# EAGLE design t2313_attiny_fusebit_hv-doctor_V3 (EAGLE 5.10)
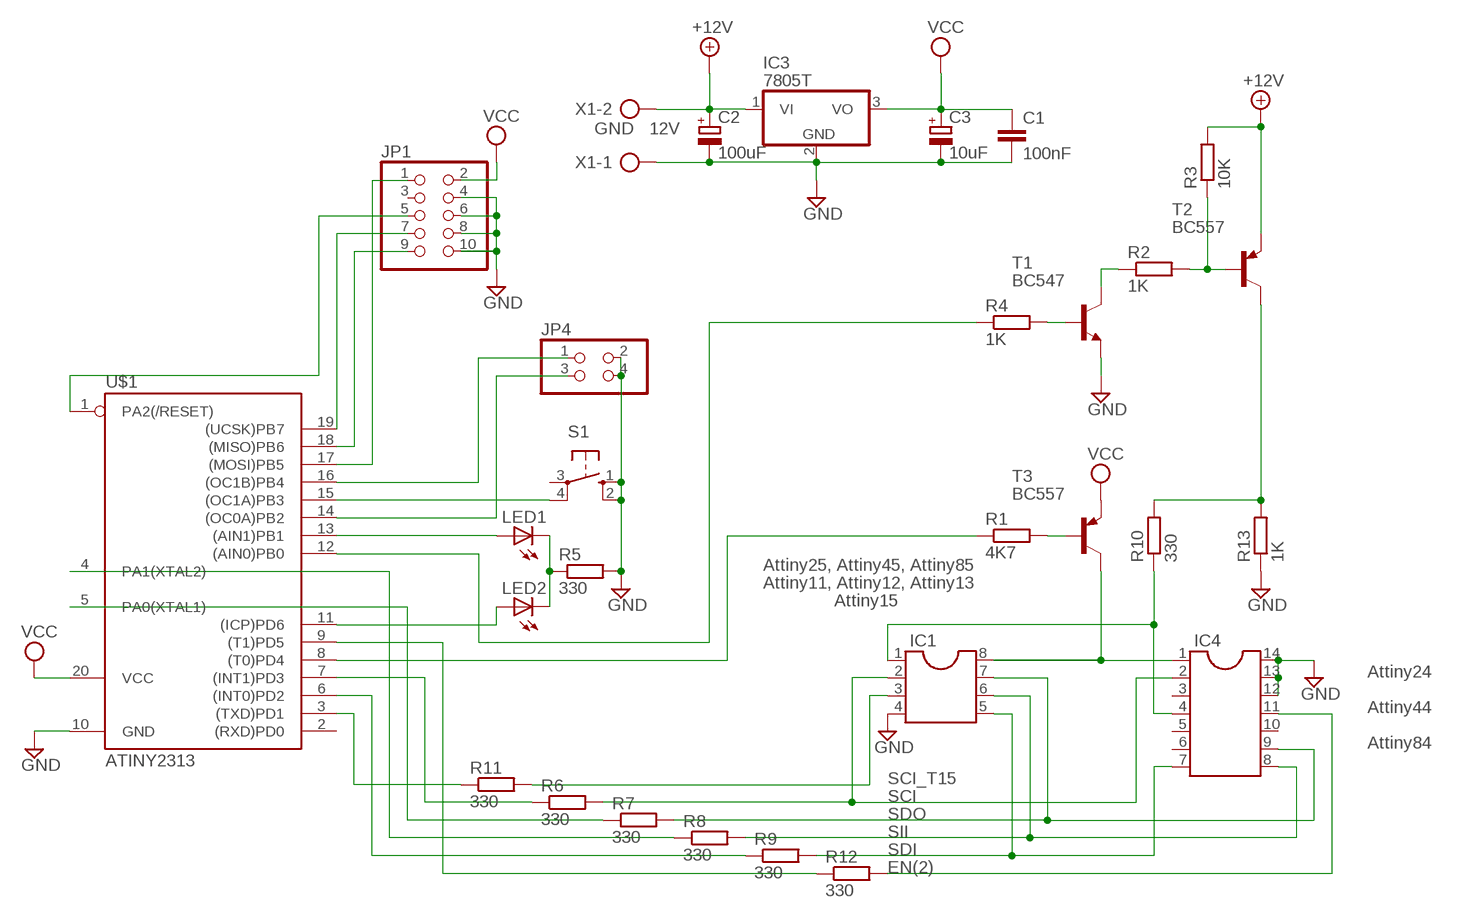
[diagram p0: schematic, sheet 1]

## Parts
C1  100nF  C-EU050-024X044  [C050-024X044]
C2  100uF  CPOL-EUE2.5-6  [E2,5-6]
C3  10uF  CPOL-EUE2.5-6  [E2,5-6]
IC1  DIL8S  [SOCKED-08]
IC3  7805T  [TO220H]
IC4  DIL14S  [SOCKED-14]
JP1  PINHD-2X5  [2X05]
JP4  PINHD-2X2  [2X02]
LED1  LED3MM  [LED3MM]
LED2  LED3MM  [LED3MM]
R1  4K7  R-EU_0207/10  [0207/10]
R2  1K  R-EU_0207/10  [0207/10]
R3  10K  R-EU_0207/10  [0207/10]
R4  1K  R-EU_0207/10  [0207/10]
R5  330  R-EU_0207/10  [0207/10]
R6  330  R-EU_0207/10  [0207/10]
R7  330  R-EU_0207/10  [0207/10]
R8  330  R-EU_0207/10  [0207/10]
R9  330  R-EU_0207/10  [0207/10]
R10  330  R-EU_0207/10  [0207/10]
R11  330  R-EU_0207/10  [0207/10]
R12  330  R-EU_0207/10  [0207/10]
R13  1K  R-EU_0207/10  [0207/10]
S1  10-XX  [B3F-10XX]
T1  BC547  BC547A-NPN-TO92-EBC  [TO92-EBC]
T2  BC557  BC557A-PNP-TO92-EBC  [TO92-EBC]
T3  BC557  BC557A-PNP-TO92-EBC  [TO92-EBC]
U$1  ATINY2313  TINY2313-*P*  [DIL20]
X1  GND 12V  AK500/2  [AK500/2]

## Nets
+12V: C2.+ IC3.1(VI) R3.2 T2.E X1.2
GND: C1.2 C2.- C3.- IC1.4 IC3.2(GND) IC4.12 IC4.13 IC4.14 JP1.4 JP1.6 JP1.8 JP1.10 JP4.2 JP4.4 R5.2 R13.1 S1.1(S) S1.2(S1) T1.E U$1.10(GND) X1.1
N$1: R4.1 U$1.12((AIN0)PB0)
N$2: R1.1 U$1.8((T0)PD4)
N$3: R7.1 U$1.5(PA0(XTAL1))
N$4: R8.1 U$1.4(PA1(XTAL2))
N$5: LED1.K(C) LED2.K(C) R5.1
N$6: R1.2 T3.B
N$7: IC1.1 IC4.4 R10.1
N$8: R2.2 R3.1 T2.B
N$9: R2.1 T1.C
N$10: R4.2 T1.B
N$11: LED1.A U$1.13((AIN1)PB1)
N$12: JP1.5 U$1.1(PA2(/RESET))
N$13: JP1.7 U$1.19((UCSK)PB7)
N$14: JP1.9 U$1.18((MISO)PB6)
N$15: JP1.1 U$1.17((MOSI)PB5)
N$16: IC4.11 R12.2
N$18: JP4.1 U$1.16((OC1B)PB4)
N$19: R6.1 U$1.7((INT1)PD3)
N$20: LED2.A U$1.11((ICP)PD6)
N$21: R12.1 U$1.9((T1)PD5)
N$22: R9.1 U$1.6((INT0)PD2)
N$23: JP4.3 U$1.14((OC0A)PB2)
N$24: S1.4(P1) U$1.15((OC1A)PB3)
N$25: R10.2 R13.2 T2.C
N$26: IC1.3 R11.2
N$27: R11.1 U$1.3((TXD)PD1)
N$29: IC1.8 IC4.1 T3.C
SCI: IC1.2 IC4.2 R6.2
SDI: IC1.5 IC4.7 R9.2
SDO: IC1.7 IC4.9 R7.2
SII: IC1.6 IC4.8 R8.2
VCC: C1.1 C3.+ IC3.3(VO) JP1.2 T3.E U$1.20(VCC)
Unconnected: IC4.3 IC4.5 IC4.6 IC4.10 JP1.3 S1.3(P) U$1.2((RXD)PD0)

## Notes on the sheet
- Attiny25, Attiny45, Attiny85
- Attiny11, Attiny12, Attiny13
- Attiny15
- Attiny24
- Attiny44
- Attiny84
- SCI_T15
- SCI
- SDO
- SII
- SDI
- EN(2)

## Library data of the parts
C1 = rcl:C-EU: CAPACITOR, European symbol
C2 C3 = rcl:CPOL-EU: POLARIZED CAPACITOR, European symbol
IC1 = ic-package:DIL8: Dual In Line
IC3 = linear:78*: Positive VOLTAGE REGULATOR Source: http://cache.national.com/ds/LM/LM78L05.pdf http://www.fairchildsemi.com/ds/LM/LM7805.pdf
IC4 = ic-package:DIL14: Dual In Line
JP1 = pinhead:PINHD-2X5: PIN HEADER
JP4 = pinhead:PINHD-2X2: PIN HEADER
LED1 LED2 = led:LED: LED OSRAM: - CHIPLED LG R971, LG N971, LY N971, LG Q971, LY Q971, LO R971, LY R971 LH N974, LH R974 LS Q976, LO Q976, LY Q976 LO Q996 - Hyper CHIPLED LW Q18S LB Q993, LB Q99A, LB R99A - SideLED LS A670, LO A670, LY A670, LG A670, LP A670 LB A673, LV A673, LT A673, LW A673 LH A674 LY A675 LS A676, LA A676, LO A676, LY A676, LW A676 LS A679, LY A679, LG A679 - Hyper Micro SIDELED® LS Y876, LA Y876, LO Y876, LY Y876 LT Y87S - SmartLED LW L88C, LW L88S LB L89C, LB L89S, LG L890 LS L89K, LO L89K, LY L89K LS L896, LA L896, LO L896, LY L896 - TOPLED LS T670, LO T670, LY T670, LG T670, LP T670 LSG T670, LSP T670, LSY T670, LOP T670, LYG T670 LG T671, LOG T671, LSG T671 LB T673, LV T673, LT T673, LW T673 LH T674 LS T676, LA T676, LO T676, LY T676, LB T676, LH T676, LSB T676, LW T676 LB T67C, LV T67C, LT T67C, LS T67K, LO T67K, LY T67K, LW E67C LS E67B, LA E67B, LO E67B, LY E67B, LB E67C, LV E67C, LT E67C LW T67C LS T679, LY T679, LG T679 LS T770, LO T770, LY T770, LG T770, LP T770 LB T773, LV T773, LT T773, LW T773 LH T774 LS E675, LA E675, LY E675, LS T675 LS T776, LA T776, LO T776, LY T776, LB T776 LHGB T686 LT T68C, LB T68C - Hyper Mini TOPLED® LB M676 - Mini TOPLED Santana® LG M470 LS M47K, LO M47K, LY M47K Source: http://www.osram.convergy.de - LUMILED® LXK2-PW12-R00, LXK2-PW12-S00, LXK2-PW14-U00, LXK2-PW14-V00 LXK2-PM12-R00, LXK2-PM12-S00, LXK2-PM14-U00 LXK2-PE12-Q00, LXK2-PE12-R00, LXK2-PE12-S00, LXK2-PE14-T00, LXK2-PE14-U00 LXK2-PB12-K00, LXK2-PB12-L00, LXK2-PB12-M00, LXK2-PB14-N00, LXK2-PB14-P00, LXK2-PB14-Q00 LXK2-PR12-L00, LXK2-PR12-M00, LXK2-PR14-Q00, LXK2-PR14-R00 LXK2-PD12-Q00, LXK2-PD12-R00, LXK2-PD12-S00 LXK2-PH12-R00, LXK2-PH12-S00 LXK2-PL12-P00, LXK2-PL12-Q00, LXK2-PL12-R00 Source: www.luxeon.com
R1-R13 = rcl:R-EU_: RESISTOR, European symbol
S1 = switch-omron:10-XX: OMRON SWITCH
T1 = transistor:*-NPN-: NPN Transistror
T2 T3 = transistor:*-PNP-: PNP Transistror
U$1 = avr-6:TINY2313*: Atmel Tiny2313 2K Flash, 128 bytes EEPROM, 128 bytes RAM
X1 = con-ptr500:AK500/2: CONNECTOR

## Board
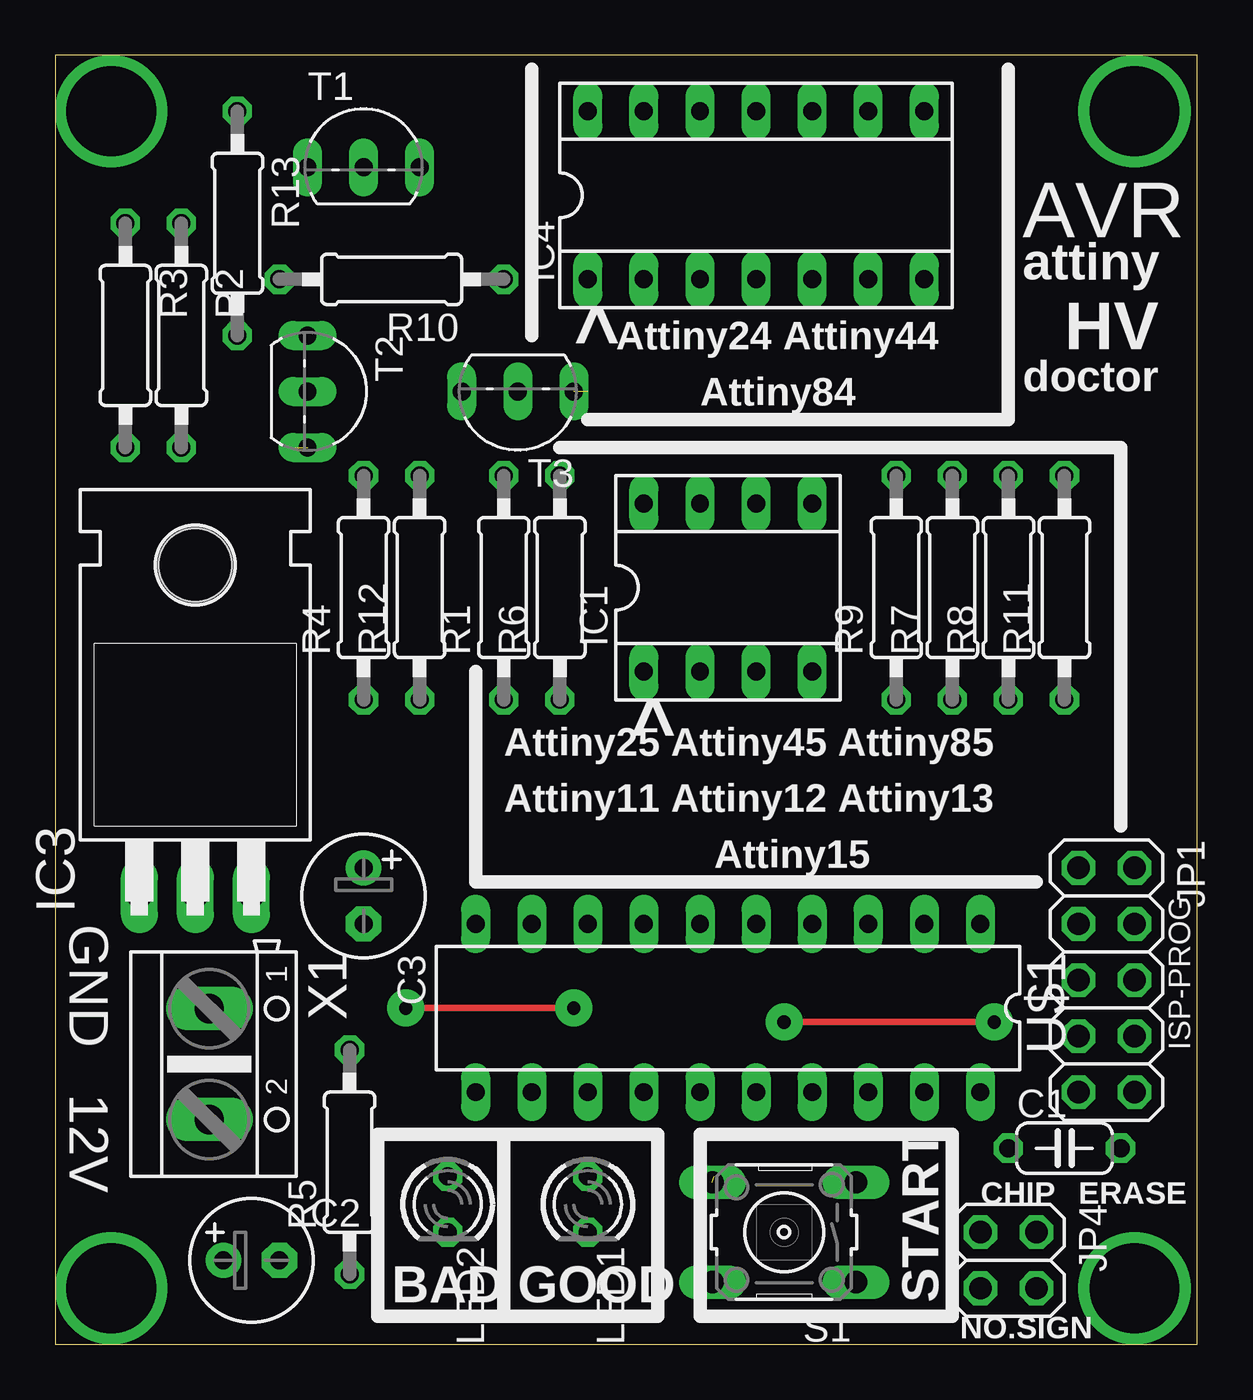
[diagram p1: board, top side]
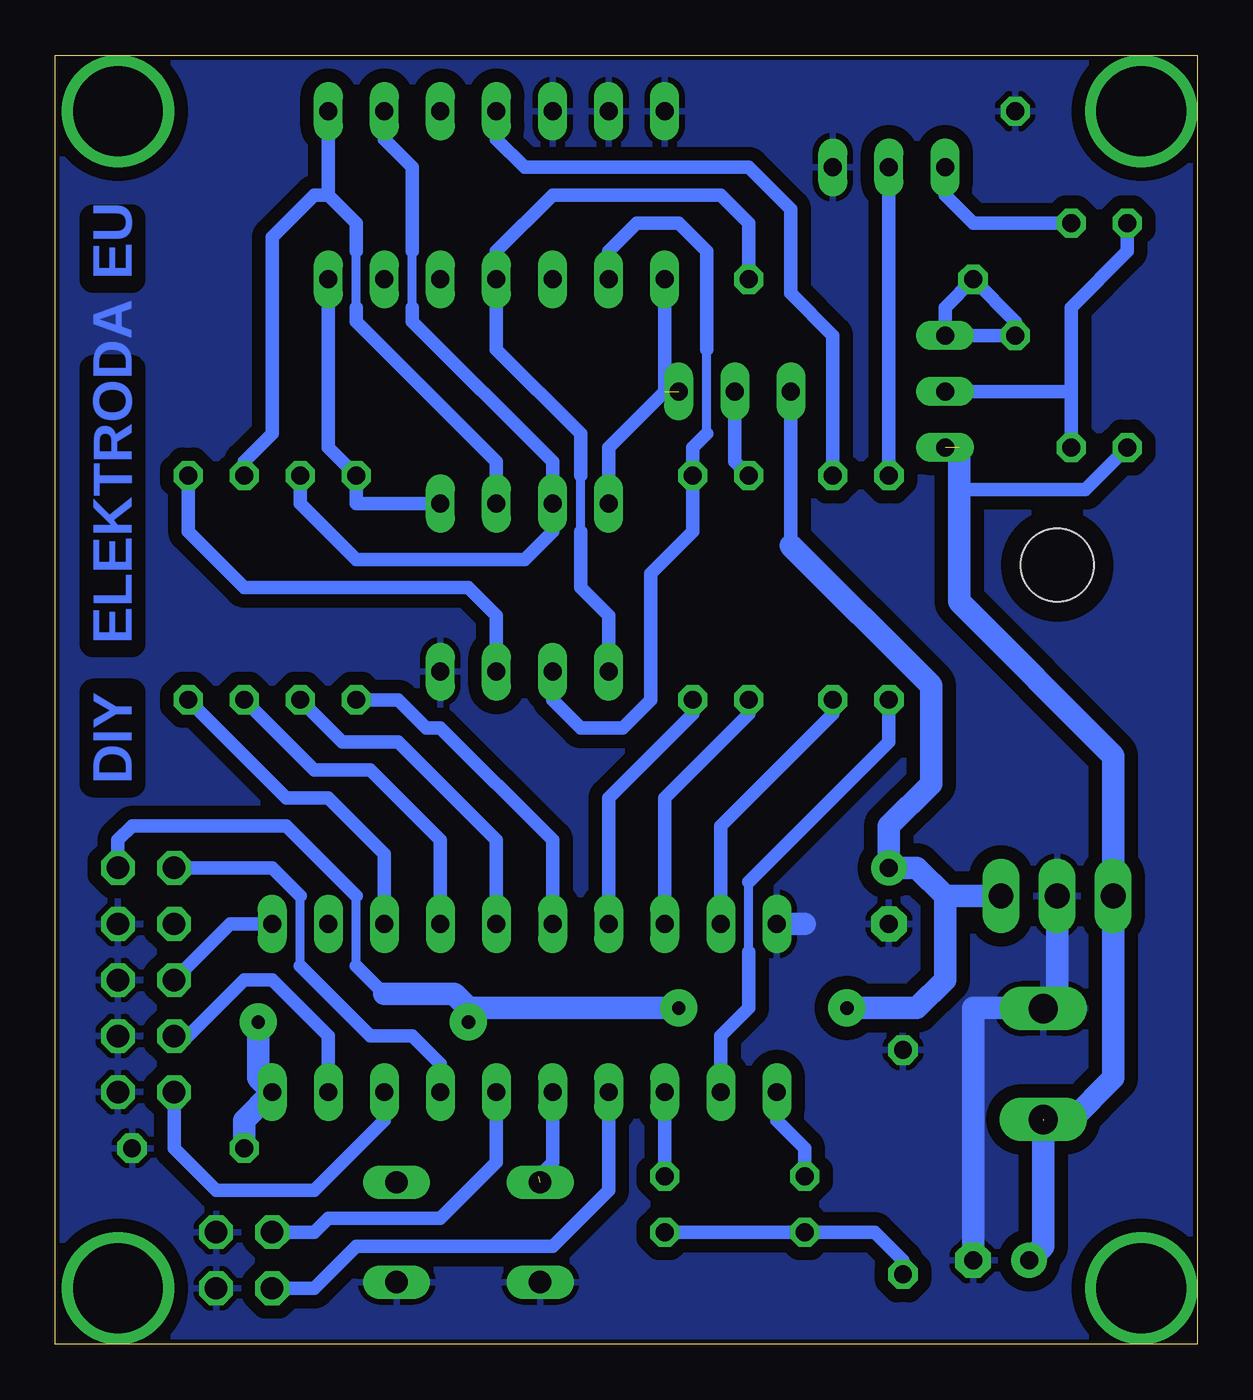
[diagram p2: board, bottom side, seen from below]

Size 51.74 x 58.41 mm. Coordinates in mm from the lower left corner, seen from the top.
Outline: 0,0 51.74,0 51.74,58.41 0,58.41 0,0
Copper layers (1*16): Top 0.035mm / dielectric 1.5mm / Bottom 0.035mm
Design rules "default *": minimum track width 10mil, minimum drill 24mil, track to track 24mil, track to pad 24mil, pad to pad 24mil, via to via 24mil, smd to smd 24mil, copper to edge 8mil, drill to drill 8mil, minimum pad ring 10mil, minimum via ring 8mil, stop-mask expansion 4mil, vias tented up to drill 0mil, thermal gap 10mil

### Footprints (pad centres in the part's own frame; a part is rotated, then mirrored left to right if it is on the bottom)
C050-024X044 = drill 0.813 octagon: 1 -2.54,0; 2 2.54,0
E2,5-6 = drill 0.813 pad 1.6 round: + -1.27,0 | drill 0.813 pad 1.6 octagon: - 1.27,0
SOCKED-08 = drill 0.813 long: 1 -3.81,-3.81; 2 -1.27,-3.81; 3 1.27,-3.81; 4 3.81,-3.81; 5 3.81,3.81; 6 1.27,3.81; 7 -1.27,3.81; 8 -3.81,3.81
TO220H = drill 1.118 long: 1 -2.54,-10.16; 2 0,-10.16; 3 2.54,-10.16 | hole 3.302: 0,4.826
SOCKED-14 = drill 0.813 long: 1 -7.62,-3.81; 2 -5.08,-3.81; 3 -2.54,-3.81; 4 0,-3.81; 5 2.54,-3.81; 6 5.08,-3.81; 7 7.62,-3.81; 8 7.62,3.81; 9 5.08,3.81; 10 2.54,3.81; 11 0,3.81; 12 -2.54,3.81; 13 -5.08,3.81; 14 -7.62,3.81
2X05 = drill 1.016 octagon: 1 -5.08,-1.27; 2 -5.08,1.27; 3 -2.54,-1.27; 4 -2.54,1.27; 5 0,-1.27; 6 0,1.27; 7 2.54,-1.27; 8 2.54,1.27; 9 5.08,-1.27; 10 5.08,1.27
2X02 = drill 1.016 octagon: 1 -1.27,-1.27; 2 -1.27,1.27; 3 1.27,-1.27; 4 1.27,1.27
LED3MM = drill 0.813 octagon: A -1.27,0; K 1.27,0
0207/10 = drill 0.813 octagon: 1 -5.08,0; 2 5.08,0
B3F-10XX = drill 1.016 long: 1 -3.251,2.261; 2 3.251,2.261; 3 -3.251,-2.261; 4 3.251,-2.261
TO92-EBC = drill 0.813 long: B 0,-1.27; C -2.54,-1.27; E 2.54,-1.27
DIL20 = drill 0.813 long: 1 -11.43,-3.81; 2 -8.89,-3.81; 3 -6.35,-3.81; 4 -3.81,-3.81; 5 -1.27,-3.81; 6 1.27,-3.81; 7 3.81,-3.81; 8 6.35,-3.81; 9 8.89,-3.81; 10 11.43,-3.81; 11 11.43,3.81; 12 8.89,3.81; 13 6.35,3.81; 14 3.81,3.81; 15 1.27,3.81; 16 -1.27,3.81; 17 -3.81,3.81; 18 -6.35,3.81; 19 -8.89,3.81; 20 -11.43,3.81
AK500/2 = drill 1.321 long: 1 -2.515,0; 2 2.515,0

### Placement (x,y rotation side)
C1  45.72,8.89 0 top
C2  8.89,3.81 0 top
C3  13.97,20.32 270 top
IC1  30.48,34.29 0 top
IC3  6.35,30.48 0 top
IC4  31.75,52.07 0 top
JP1  47.62,16.51 270 top
JP4  43.18,3.81 270 top
LED1  24.13,6.35 270 top
LED2  17.78,6.35 270 top
R1  20.32,34.29 90 top
R2  5.71,45.72 270 top
R3  3.17,45.72 270 top
R4  13.97,34.29 90 top
R5  13.34,8.26 90 top
R6  22.86,34.29 90 top
R7  40.64,34.29 90 top
R8  43.18,34.29 90 top
R9  38.1,34.29 90 top
R10  15.24,48.26 180 top
R11  45.72,34.29 90 top
R12  16.51,34.29 90 top
R13  8.26,50.8 270 top
S1  33.02,5.08 180 top
T1  13.97,54.61 0 top
T2  12.7,43.18 270 top
T3  20.95,41.91 180 top
U$1  30.48,15.24 180 top
X1  6.99,12.7 270 top

### Tracks (layer width: path | path; a pad name or v marks a point on that pad's centre or on a via)
+12V  (2 unrouted)
  Bottom 0.61: IC3.1 3.81,19.68 | 10.79,38.73 5.08,38.73 R3.2
  Bottom 1.016: C2.+ 6.99,4.45 6.99,10.16 5.71,10.16 3.81,12.06 IC3.1 3.81,26.67 10.79,33.66 10.79,38.73 10.79,40.64
GND
  Bottom 0.61: IC3.2 6.35,21.59
  Bottom 1.016: IC3.2 6.35,15.24 10.16,15.24 C2.- | U$1.10 17.78,19.05
  pour Bottom: 0,58.42 52.07,58.42 52.07,0 0,0
N$1
  Bottom 0.406: 20.32,17.78 20.32,20.95
  Bottom 0.61: 20.32,17.78 20.32,15.24 21.59,13.97 U$1.12 | R4.1 13.97,27.3 20.32,20.95
N$2
  Bottom 0.61: R1.1 20.32,28.57 24.13,24.77 U$1.8
N$3
  Bottom 0.61: R7.1 38.73,27.3 36.2,27.3 31.75,22.86 U$1.5
N$4
  Bottom 0.61: R8.1 40.01,26.04 37.47,26.04 34.29,22.86 U$1.4
N$5
  Bottom 0.61: R5.1 13.34,3.81 14.61,5.08 LED2.K LED1.K
N$6
  Bottom 0.61: R1.2 20.95,40.01 T3.B
N$7
  Bottom 0.406: 27.94,36.83 27.94,39.37
  Bottom 0.61: IC1.1 26.67,33.02 27.94,34.29 27.94,36.83 | 27.94,39.37 27.94,41.27 31.75,45.09 IC4.4 31.75,49.53 29.21,52.07 21.59,52.07 20.32,50.8 R10.1
N$8
  Bottom 0.61: R2.2 5.71,43.18 | 5.71,43.18 5.71,46.99 3.17,49.53 R3.1 | 5.71,43.18 T2.B
N$9
  Bottom 0.61: R2.1 10.16,50.8 11.43,52.07 T1.C
N$10
  Bottom 0.61: R4.2 T1.B
N$11
  Bottom 0.61: LED1.A 24.13,10.16 U$1.13
N$12
  Bottom 0.61: U$1.1 43.81,19.05 JP1.5
N$13
  Bottom 0.61: U$1.19 39.37,13.97 41.91,16.51 43.18,16.51 45.72,13.97 JP1.7
N$14
  Bottom 0.61: U$1.18 36.83,10.16 40.01,6.99 44.45,6.99 46.35,8.89 JP1.9
N$15
  Bottom 0.406: 40.64,17.14 40.64,20.32
  Bottom 0.61: U$1.17 34.29,12.7 35.56,13.97 37.47,13.97 40.64,17.14 | 40.64,20.32 41.91,21.59 JP1.1
N$16
  Bottom 0.61: IC4.11 31.75,54.61 30.48,53.34 20.32,53.34 18.41,51.44 18.41,47.62 16.51,45.72 R12.2
N$17  (via drill 4.06 pad 5.08)
  other vias: 2.54,55.88
N$18
  Bottom 0.61: U$1.16 31.75,8.26 34.29,5.71 39.37,5.71 40.01,5.08 JP4.1
N$19
  Bottom 0.61: R6.1 22.86,28.57 26.67,24.77 U$1.7
N$20
  Bottom 0.61: LED2.A 17.78,8.89 19.05,10.16 U$1.11
N$21
  Bottom 0.61: R12.1 16.51,28.57 21.59,23.5 U$1.9
N$22
  Bottom 0.61: R9.1 36.2,29.21 34.92,27.94 34.29,27.94 29.21,22.86 U$1.6
N$23
  Bottom 0.61: U$1.14 26.67,6.99 29.21,4.45 38.1,4.45 40.01,2.54 JP4.3
N$24  (1 unrouted)
  Bottom 0.61: 29.84,7.62 29.21,8.26 U$1.15
N$25
  Bottom 0.61: 11.43,46.99 R10.2 8.26,46.35 R13.2 T2.C 11.43,46.99
N$26
  Bottom 0.61: IC1.3 31.75,33.02 33.02,34.29 43.18,34.29 45.72,36.83 R11.2
N$27
  Bottom 0.61: R11.1 41.27,24.77 39.37,24.77 36.83,22.23 U$1.3
N$28  (via drill 4.06 pad 5.08)
  other vias: 2.54,2.54
N$29  (1 unrouted)
  Bottom 0.61: IC4.1 24.13,43.18 26.67,40.64 IC1.8
N$32  (via drill 4.06 pad 5.08)
  other vias: 48.9,2.54
N$33  (via drill 4.06 pad 5.08)
  other vias: 48.9,55.88
SCI
  Bottom 0.406: 22.23,41.27 22.23,45.09
  Bottom 0.61: IC4.2 26.67,49.53 25.4,50.8 23.5,50.8 22.23,49.53 22.23,45.09 | 22.23,41.27 22.86,40.64 R6.2 22.86,36.83 24.77,34.92 24.77,29.21 26.04,27.94 27.94,27.94 29.21,29.21 IC1.2
SDI
  Bottom 0.61: IC4.7 39.37,40.64 R9.2 38.1,38.1 IC1.5
SDO
  Bottom 0.406: 35.56,46.99 35.56,49.53
  Bottom 0.61: IC4.9 36.83,54.61 35.56,53.34 35.56,49.53 | 35.56,46.99 35.56,46.35 29.21,40.01 IC1.7 29.21,36.83 30.48,35.56 38.1,35.56 40.64,38.1 R7.2
SII
  Bottom 0.406: 38.1,46.99 38.1,49.53
  Bottom 0.61: 39.37,52.07 IC4.8 | 39.37,52.07 38.1,50.8 38.1,49.53 | 38.1,46.99 38.1,46.35 31.75,40.01 IC1.6 | 39.37,52.07 40.01,52.07 41.91,50.16 41.91,41.27 43.18,40.01 R8.2
VCC  (via drill 0.6 pad 1.68)
  Top 0.305: v33.02,14.61 v42.55,14.61 | v15.88,15.24 v23.5,15.24
  Bottom 0.406: 38.1,17.14 38.1,20.32
  Bottom 0.61: 36.83,15.88 38.1,17.14 | 38.1,20.32 41.27,23.5 48.26,23.5 48.9,22.86 JP1.2 | 18.41,36.2 T3.E
  Bottom 1.016: 18.41,36.2 12.06,29.84 12.06,25.4 13.97,23.5 C3.+ 12.7,21.59 11.43,20.32 | 33.02,15.24 33.66,15.88 36.83,15.88 | v23.5,15.24 33.02,15.24 | 11.43,20.32 IC3.3 | 33.02,15.24 v33.02,14.61 | v42.55,14.61 42.55,12.06 U$1.20 43.18,10.16 C1.1 | 11.43,20.32 11.43,16.51 12.7,15.24 v15.88,15.24

### Text on the board
Bottom: EU | ELEKTRODA | DIY
tPlace: AVR | attiny | Attiny24 Attiny44 | HV | ^ | Attiny84 | doctor | Attiny25 Attiny45 Attiny85 | ^ | Attiny11 Attiny12 Attiny13 | Attiny15 | ISP-PROG | CHIP | ERASE | BAD | GOOD | START | NO.SIGN